# Altium project МИЭМ.467999.001.PrjPcb
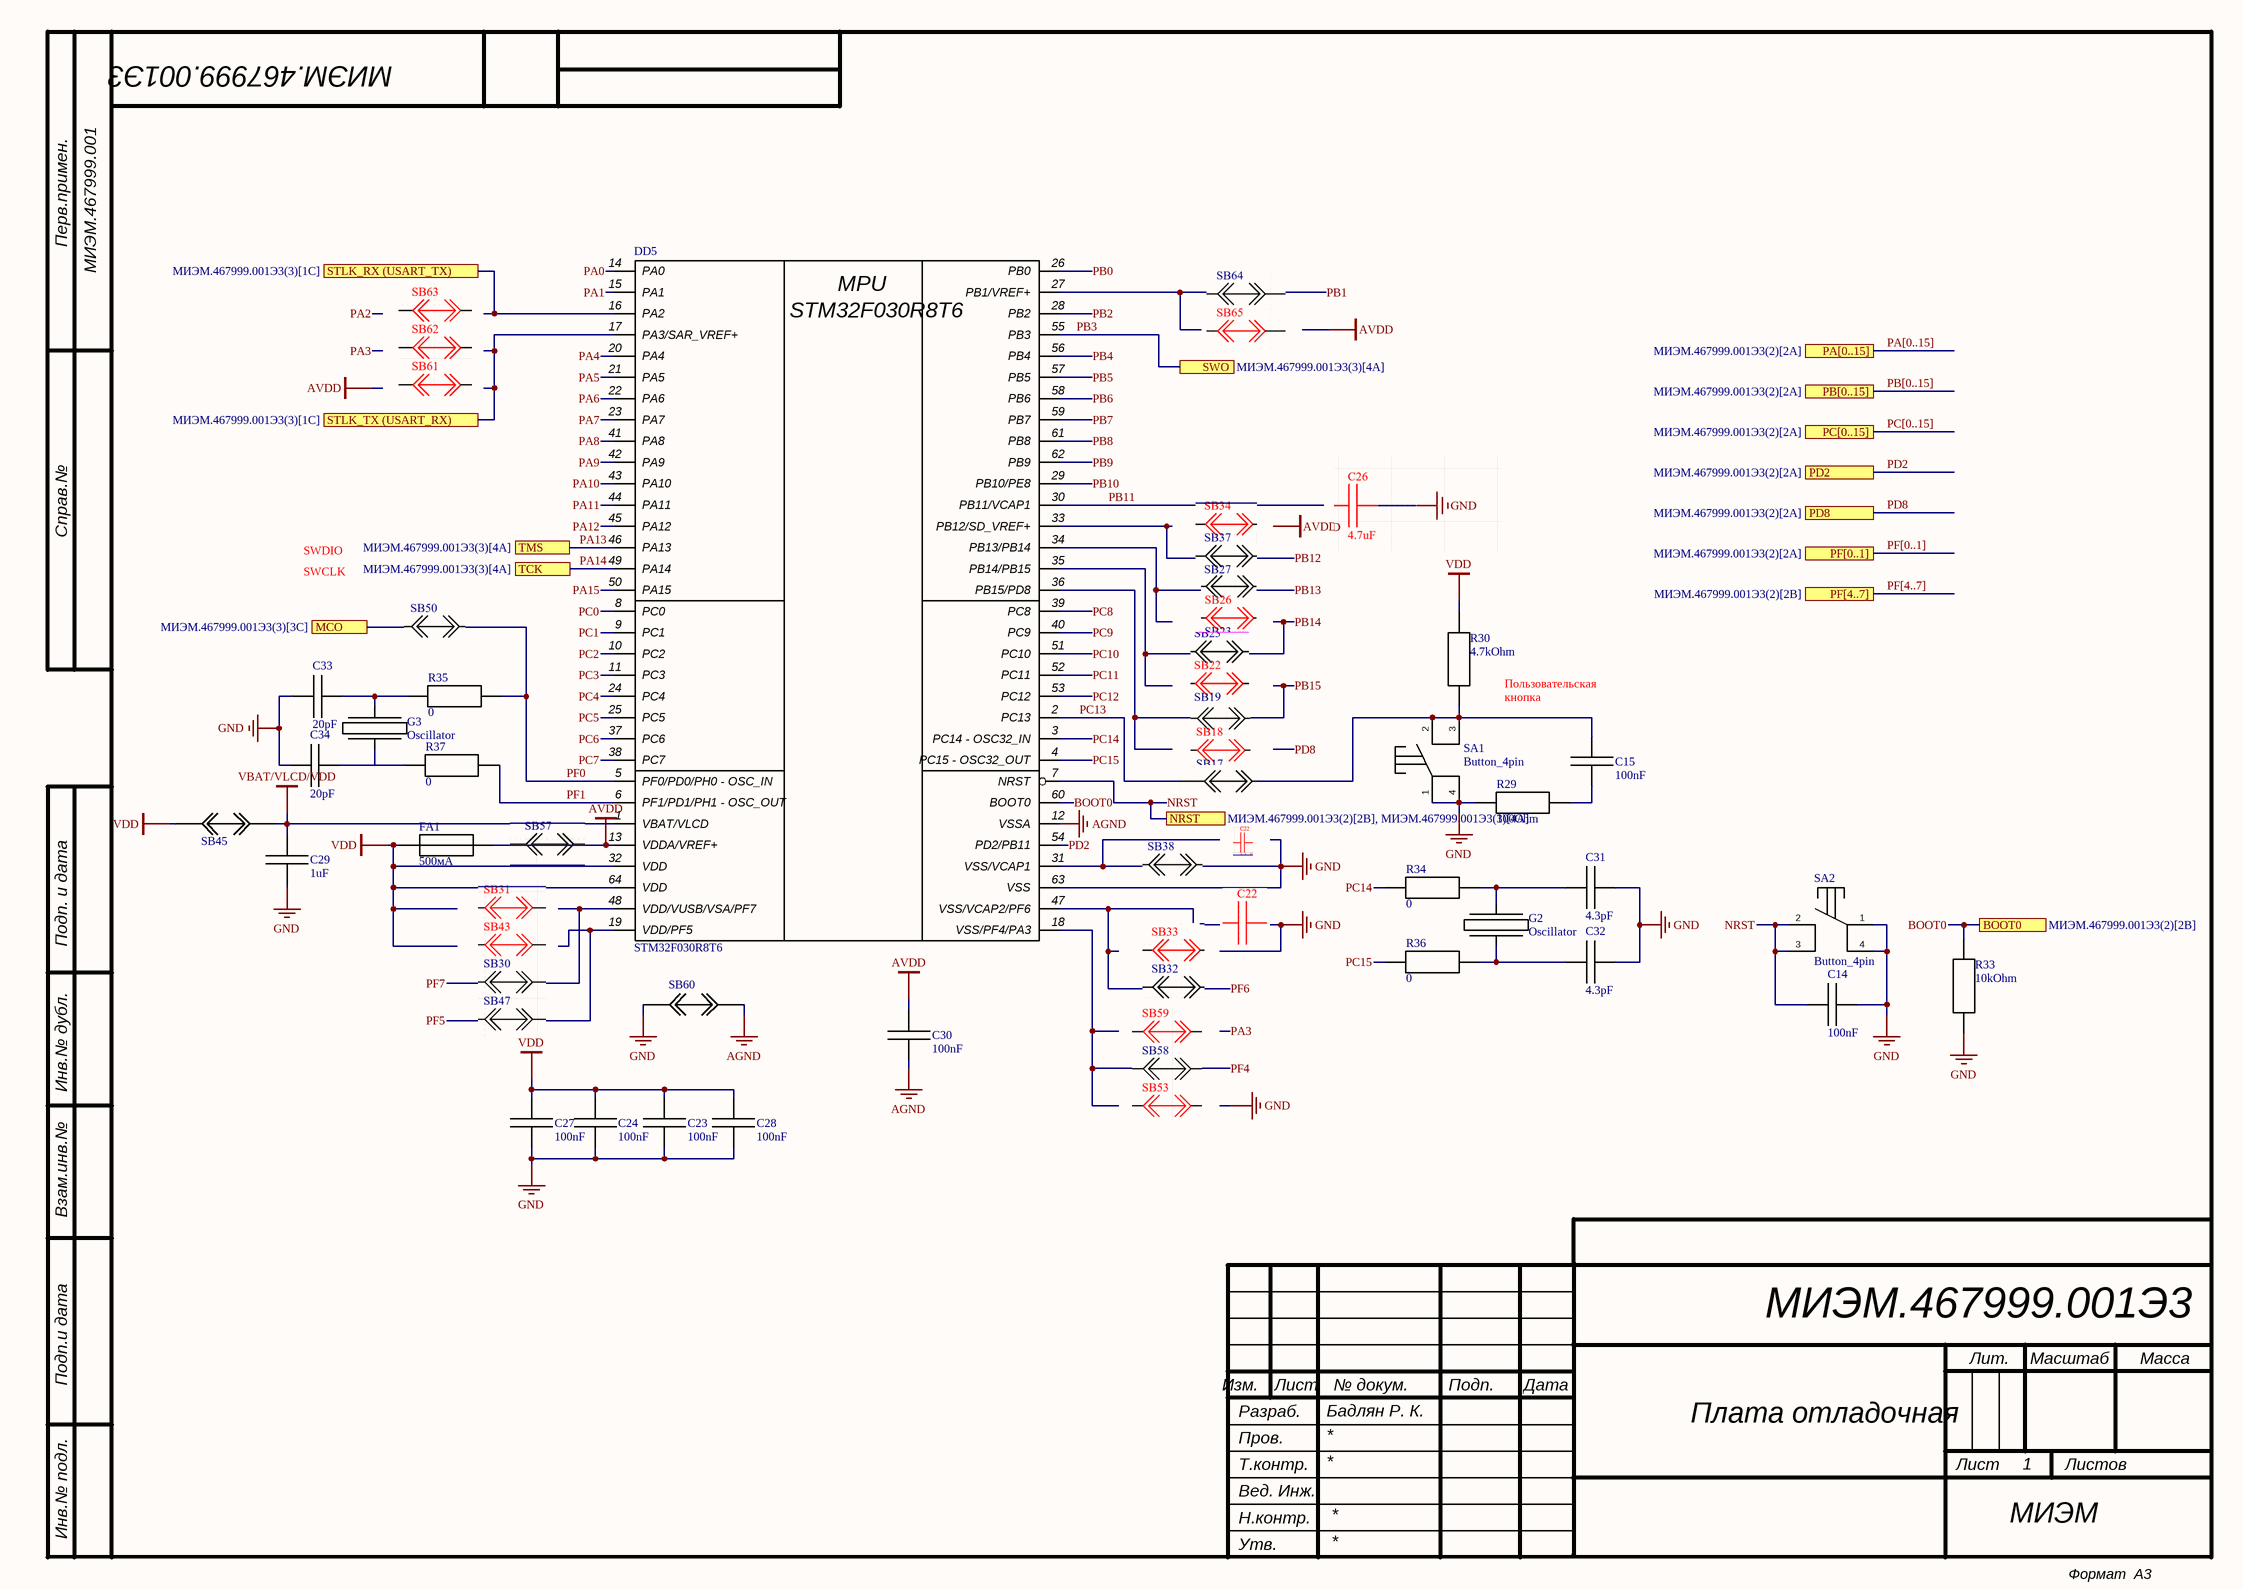
[diagram p0: МИЭМ.467999.001Э3.SchDoc]
Вид_документа_SCH: Схема электрическая принципиальная; Документация0: А3#МИЭМ.467999.001#Схема электрическая принципиальная (Э3)#Э3##; Документация1: А4#МИЭМ.467999.001#Перечень элементов (ПЭ3)#ПЭ3##; Документация2: А3#МИЭМ.467999.001#Ведомость покупных изделий (ВП)#ВП##; Документация3: А3#МИЭМ.467999.001#Сборочный чертеж (СБ)#СБ##; Код_документа_SCH: Э3; Наименование: Плата отладочная; Наименование1: Плата отладочная; Наименование_PCB: Плата печатная многослойная; Обозначение: МИЭМ.467999.001; Обозначение_PCB: МИЭМ.687253.001; Обозначение_Код: МИЭМ.467999.001Э3; Формат_PCB: А3; Характер_работы: Вед. Инж.; п_Доп_графа: Бадалян; п_Доп_графа_Р: Бадалян; п_Разраб: Бадалян; п_Разраб_Р: Бадалян
4 sheets, 112 parts. Net scope: flat (ports and power ports of the same name join across sheets).
Board file: МИЭМ.467999.001.PcbDoc
Sheets:
  МИЭМ.467999.001Э3.SchDoc
  МИЭМ.467999.001Э3(2).SchDoc
  МИЭМ.467999.001Э3(3).SchDoc
  МИЭМ.467999.001Э3(4).SchDoc

## Sheet МИЭМ.467999.001Э3.SchDoc
size 420 x 297 mm; Author: Бадлян Р. К.; CompanyName: МИЭМ; Organization: МИЭМ; SheetNumber: 1; SheetTotal: 4; Name: Плата отладочная; DecimalNumber: МИЭМ.467999.001Э3; MainDevice: МИЭМ.467999.001; Job_Title: Вед. Инж.

### Parts
C14  100nF  [0603]
C15  100nF  [0603]
C23  100nF  [0603]
C24  100nF  [0603]
C27  100nF  [0603]
C28  100nF  [0603]
C29  1uF  [0603]
C30  100nF  [0603]
C31  4.3pF  [0603]
C32  4.3pF  [0603]
C33  20pF  [0603]
C34  20pF  [0603]
DD5  STM32F030R8T6  [LQFP64-10x10mm]
FA1  500мА  [FCM1608KF-601T05]
G2  Oscillator  [ABS25-32.768KHZ-6-T]
G3  Oscillator  [HC49SMD]
R29  100Ohm  [0603]
R30  4.7kOhm  [0603]
R33  10kOhm  [0603]
R34  0  [0603]
R35  0  [0603]
R36  0  [0603]
R37  0  [0603]
SA1  Button_4pin  [Button_4pin]
SA2  Button_4pin  [Button_4pin]
SB45  Jumper  [Jumper]  (value not drawn)
SB60  Jumper  [Jumper]  (value not drawn)

### Ports
BOOT0 (see МИЭМ.467999.001Э3(2)[2B]), MCO (see МИЭМ.467999.001Э3(3)[3C]), NRST (see МИЭМ.467999.001Э3(2)[2B], МИЭМ.467999.001Э3(3)[4A]), PA[0..15] (see МИЭМ.467999.001Э3(2)[2A]), PB[0..15] (see МИЭМ.467999.001Э3(2)[2A]), PC[0..15] (see МИЭМ.467999.001Э3(2)[2A]), PD2 (see МИЭМ.467999.001Э3(2)[2A]), PD8 (see МИЭМ.467999.001Э3(2)[2A]), PF[0..1] (see МИЭМ.467999.001Э3(2)[2A]), PF[4..7] (see МИЭМ.467999.001Э3(2)[2B]), STLK_RX (USART_TX) (see МИЭМ.467999.001Э3(3)[1C]), STLK_TX (USART_RX) (see МИЭМ.467999.001Э3(3)[1C]), SWO (see МИЭМ.467999.001Э3(3)[4A]), TCK (see МИЭМ.467999.001Э3(3)[4A]), TMS (see МИЭМ.467999.001Э3(3)[4A])

### Nets
AGND: C30.1 DD5.12(VSSA) SB60.2
AVDD: C30.2 DD5.13(VDDA/VREF+) FA1.1
GND: C14.1 C23.1 C24.1 C27.1 C28.1 C29.1 C31.1 C32.1 C33.2 C34.2 DD5.31(VSS/VCAP1) DD5.63(VSS) R29.1 R33.1 SA1.1 SA1.4 SA2.1 SA2.4 SB60.1
VBAT/VLCD/VDD: C29.2 DD5.1(VBAT/VLCD) SB45.2
VDD: C23.2 C24.2 C27.2 C28.2 DD5.32(VDD) DD5.64(VDD) FA1.2 R30.2 SB45.1
BOOT0: DD5.60(BOOT0) R33.2 ; port BOOT0
NRST: C14.2 DD5.7(NRST) SA2.2 SA2.3 ; port NRST
PA0: DD5.14(PA0)
PA1: DD5.15(PA1)
PA4: DD5.20(PA4)
PA5: DD5.21(PA5)
PA6: DD5.22(PA6)
PA7: DD5.23(PA7)
PA8: DD5.41(PA8)
PA9: DD5.42(PA9)
PA10: DD5.43(PA10)
PA11: DD5.44(PA11)
PA12: DD5.45(PA12)
PA13: DD5.46(PA13) ; port TMS
PA14: DD5.49(PA14) ; port TCK
PA15: DD5.50(PA15)
PB0: DD5.26(PB0)
PB1: DD5.27(PB1/VREF+)
PB2: DD5.28(PB2)
PB3: DD5.55(PB3) ; port SWO
PB4: DD5.56(PB4)
PB5: DD5.57(PB5)
PB6: DD5.58(PB6)
PB7: DD5.59(PB7)
PB8: DD5.61(PB8)
PB9: DD5.62(PB9)
PB10: DD5.29(PB10/PE8)
PB11: DD5.30(PB11/VCAP1)
PB12: DD5.33(PB12/SD_VREF+)
PB13: DD5.34(PB13/PB14)
PB14: DD5.35(PB14/PB15)
PB15: DD5.36(PB15/PD8)
PC0: DD5.8(PC0)
PC1: DD5.9(PC1)
PC2: DD5.10(PC2)
PC3: DD5.11(PC3)
PC4: DD5.24(PC4)
PC5: DD5.25(PC5)
PC6: DD5.37(PC6)
PC7: DD5.38(PC7)
PC8: DD5.39(PC8)
PC9: DD5.40(PC9)
PC10: DD5.51(PC10)
PC11: DD5.52(PC11)
PC12: DD5.53(PC12)
PC13: C15.2 DD5.2(PC13) R30.1 SA1.2 SA1.3
PC14: DD5.3(PC14_-_OSC32_IN) R34.1
PC15: DD5.4(PC15_-_OSC32_OUT) R36.1
PD2: DD5.54(PD2/PB11) ; port PD2
PF0: DD5.5(PF0/PD0/PH0_-_OSC_IN) R35.2 ; port MCO
PF1: DD5.6(PF1/PD1/PH1_-_OSC_OUT) R37.2
PF4: DD5.18(VSS/PF4/PA3)
PF5: DD5.19(VDD/PF5)
PF6: DD5.47(VSS/VCAP2/PF6)
PF7: DD5.48(VDD/VUSB/VSA/PF7)
STLINK_RX: DD5.16(PA2) ; port STLK_RX (USART_TX)
STLINK_TX: DD5.17(PA3/SAR_VREF+) ; port STLK_TX (USART_RX)
NetC15_1: C15.1 R29.2
NetC31_2: C31.2 G2.1 R34.2
NetC32_2: C32.2 G2.2 R36.2
NetC33_1: C33.1 G3.1 R35.1
NetC34_1: C34.1 G3.2 R37.1

### Buses and harness runs
bus PA[0..15] = port PA[0..15]
bus PB[0..15] = port PB[0..15]
bus PC[0..15] = port PC[0..15]
bus PF[0..1] = port PF[0..1]
bus PF[4..7] = port PF[4..7]

### Notes on the sheet
- SWCLK
- SWDIO
- Пользовательская кнопка
- Labels drawn without touching a wire or pin: AVDD
- Перв.примен.
- Справ.№
- Подп. и дата
- Инв.№ дубл.
- Взам.инв.№
- Подп.и дата
- Разраб.
- Изм.
- Лист
- № докум.
- Подп.
- Дата
- Лит.
- Масштаб
- Масса
- Т.контр.
- Пров.
- Листов
- Инв.№ подл.
- Утв.
- Н.контр.
- Формат  A3
- (in symbol STM32F030R8T6) MPU

### Library data of the parts
C14 C15 C23 C24 C27 C28 C30 = Сapacitor: PartNumber: CC0603KRX7R0BB104; Manufacturer: Yageo; VCC: 100В; Tolerance: 10%; Ta: 125°C; Value: 100nF; Package: 0603; ComponentLink1Description: Datasheet; ComponentLink1URL: *; ComponentLink2Description: Source; ComponentLink2URL: https://www.chipdip.ru/product/0.1mkf-x7r-100v-10-0603-cc0603krx7r0bb104-kondensator-yageo-9000578715
C29 = Сapacitor: PartNumber: GRM185R61A105K; Manufacturer: Murata Electronics; VCC: 10В; Tolerance: 10%; Ta: 85°C; Value: 1uF; Package: 0603; ComponentLink1Description: Datasheet; ComponentLink1URL: *; ComponentLink2Description: Source; ComponentLink2URL: https://www.chipdip.ru/product/1mkf-x5r-10v-10-0603-grm185r61a105k-kondensator-murata-767906735
C31 C32 = Сapacitor: PartNumber: CC0603CRNPO9BN4R3; Manufacturer: Yageo; VCC: 50В; Tolerance: 1%; Ta: 125°C; Value: 4.3pF; Package: 0603; ComponentLink1Description: Datasheet; ComponentLink1URL: *; ComponentLink2Description: Source; ComponentLink2URL: https://www.chipdip.ru/product/4.3pf-np0-50v-0.25pf-0603-cc0603crnpo9bn4r3-yageo-9000952764
C33 C34 = Сapacitor: PartNumber: GRM1885C1H200J; Manufacturer: Murata Electronics; VCC: 50В; Tolerance: 5%; Ta: 155°C; Value: 20pF; Package: 0603; ComponentLink1Description: Datasheet; ComponentLink1URL: *; ComponentLink2Description: Source; ComponentLink2URL: https://www.chipdip.ru/product/20pf-np0-50v-5-0603-grm1885c1h200j-kondensator-murata-268501846
DD5 = STM32F030R8T6: Manufacturer: STMicroelectronics; Frequency: 48МГц; Ta: 85°C; Desc: Микроконтроллер ARM; ComponentLink1Description: Source; ComponentLink1URL: https://www.chipdip.ru/product/stm32f030r8t6-mikrokontroller-arm-st-microelectronics-9000247632; Package: LQFP64-10x10; PartNumber: STM32F030R8T6; ComponentLink2Description: Datasheet; ComponentLink2URL: https://static.chipdip.ru/lib/915/DOC012915875.pdf; ClassName: STM
FA1 = Fuse: Desc: Сердечник ферритовый; Current: 500мА; Package: 0603; PartNumber: FCM1608KF-601T05; ComponentLink1Description: Datasheet; ComponentLink1URL: *; ComponentLink2Description: Source; ComponentLink2URL: https://www.chipdip.ru/product/fcm1608kf-601t05-tai-tech-8040727428
G2 = Oscillator: Desc: Осциллятор кварцевый; Frequence: 32.768КГц; Ta: 85°C; Tolerance: 0.002%; PartNumber: ABS25-32.768KHZ-6-T; ComponentLink1Description: Source; ComponentLink1URL: https://www.chipdip.ru/product/abs25-32.768khz-6-t-abracon-8001972524; ComponentLink2Description: Datasheet; ComponentLink2URL: *; Package: QSMD8x3.8
G3 = Oscillator: Desc: Осциллятор кварцевый; Frequence: 8МГц; Ta: 70°С; PartNumber: *; ComponentLink1Description: Source; ComponentLink1URL: https://www.chipdip.ru/product/hc49smd-8-mhz-20pf-30ppm-ruichi-8022445237; ComponentLink2Description: Datasheet; ComponentLink2URL: *; Tolerance: *; Package: HC49SMD
R29 = Resistor: PartNumber: AC0603FR-07100RL; Manufacturer: Yageo; VCC: 75В; Power: 0.1Вт; Ta: 155°C; Tolerance: 1%; Value: 100Ohm; Package: 0603; ComponentLink1Description: Datasheet; ComponentLink1URL: *; ComponentLink2Description: Source; ComponentLink2URL: https://www.chipdip.ru/product/0.1vt-0603-100-om-1-ac0603fr-07100rl-chip-rezistor-yageo-9000495858
R30 = Resistor: PartNumber: RC0603JR-074K7L; Manufacturer: Yageo; VCC: 75В; Power: 0.1Вт; Ta: 155°C; Tolerance: 5%; Value: 4.7kOhm; Package: 0603; ComponentLink1Description: Datasheet; ComponentLink1URL: *; ComponentLink2Description: Source; ComponentLink2URL: https://www.chipdip.ru/product/0.1vt-0603-4.7-kom-5-rc0603jr-074k7l-chip-rezistor-yageo-9000301240
R33 = Resistor: PartNumber: RC0603FR-0710KL; VCC: 50В; Power: 0.1Вт; Ta: 155°C; Tolerance: 1%; Value: 10kOhm; Package: 0603; Manufacturer: *; ComponentLink1Description: Datasheet; ComponentLink1URL: *; ComponentLink2Description: Source; ComponentLink2URL: https://www.chipdip.ru/product/0.1vt-0603-10-kom-1-chip-rezistor-smd-9000079736
R34-R37 = Resistor: PartNumber: RC0603FR-070RL; Manufacturer: Yageo; VCC: 75В; Power: 0.1Вт; Ta: 155°C; Tolerance: 1%; Value: 0; Package: 0603; ComponentLink1Description: Datasheet; ComponentLink1URL: *; ComponentLink2Description: Source; ComponentLink2URL: https://www.chipdip.ru/product/0.1vt-0603-0-om-1-rc0603fr-070rl-chip-rezistor-smd-yageo-9001227234
SA1 SA2 = Button_4pin: PartNumber: KAN0641-0431B; Desc: Выключатель кнопочный нажимной; ComponentLink1Description: Source; ComponentLink1URL: https://www.chipdip.ru/product/taktovaya-knopka-6.0x-4.3-algoritm-raboty-no-td-06xg-9000914059
SB45 SB60 = Jumper: Desc: Перемычка; State: Установлен

## Sheet МИЭМ.467999.001Э3(2).SchDoc
size 420 x 297 mm; SheetNumber: 2; SheetTotal: 4; DecimalNumber: МИЭМ.467999.001Э3
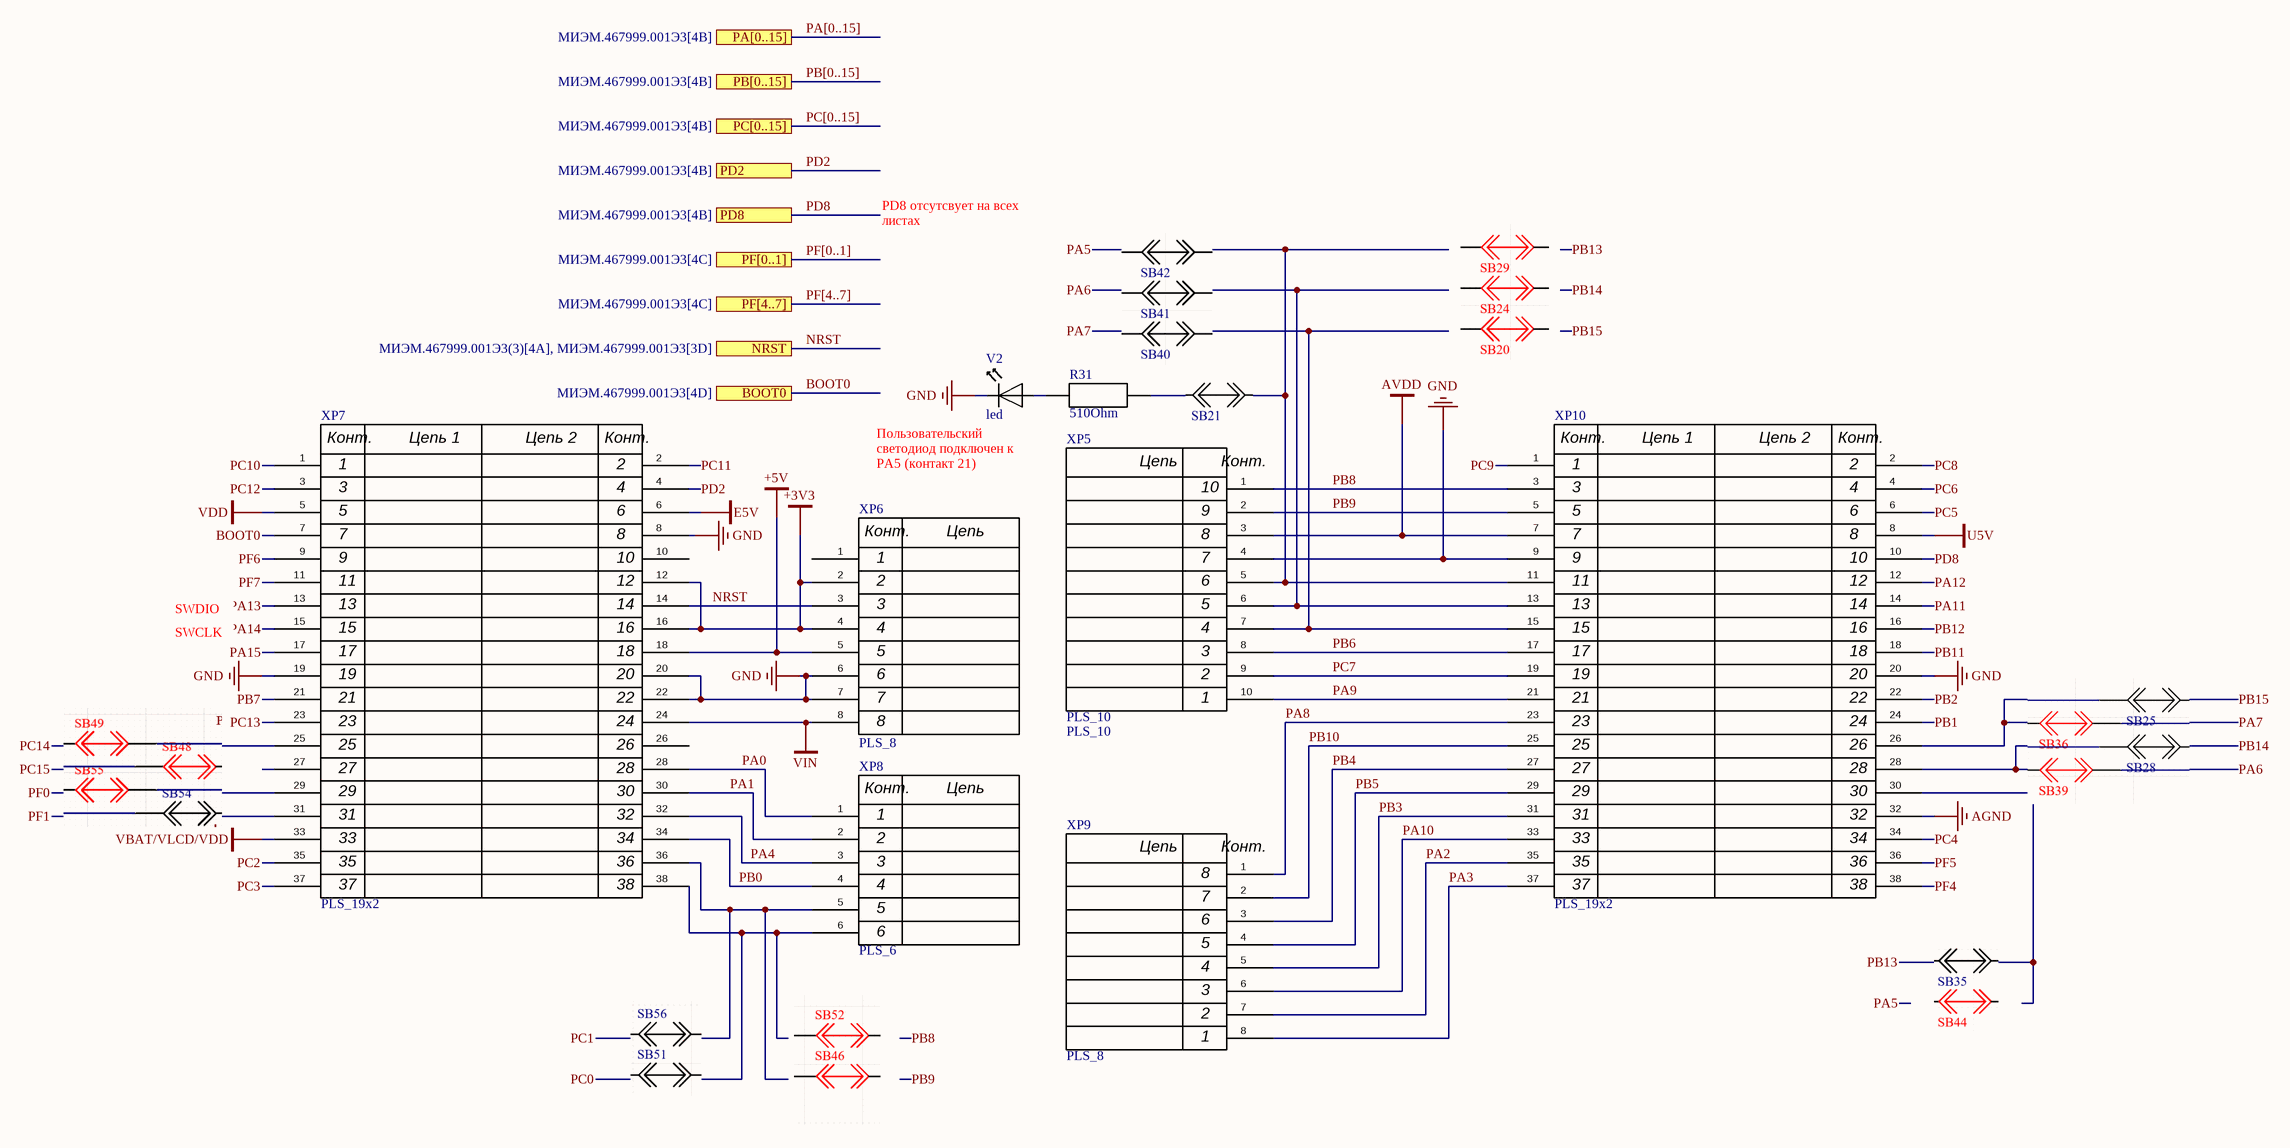
[diagram p1: МИЭМ.467999.001Э3(2).SchDoc]

### Parts
R31  510Ohm  [0603]
V2  led  [FYLS-0603PGC]
XP5  PLS_10  [PLS_10]
XP6  PLS_8  [PLS_8]
XP7  PLS_19x2  [PLS_19x2]
XP8  PLS_6  [PLS_6]
XP9  PLS_8  [PLS_8]
XP10  PLS_19x2  [PLS_19x2]

### Ports
BOOT0 (see МИЭМ.467999.001Э3[4D]), NRST (see МИЭМ.467999.001Э3(3)[4A], МИЭМ.467999.001Э3[3D]), PA[0..15] (see МИЭМ.467999.001Э3[4B]), PB[0..15] (see МИЭМ.467999.001Э3[4B]), PC[0..15] (see МИЭМ.467999.001Э3[4B]), PD2 (see МИЭМ.467999.001Э3[4B]), PD8 (see МИЭМ.467999.001Э3[4B]), PF[0..1] (see МИЭМ.467999.001Э3[4C]), PF[4..7] (see МИЭМ.467999.001Э3[4C])

### Nets
+3V3: XP6.2 XP6.4 XP7.12 XP7.16
+5V: XP6.5 XP7.18
AGND: XP10.32
AVDD: XP5.3 XP10.7
E5V: XP7.6
GND: V2.2 XP5.4 XP6.6 XP6.7 XP7.8 XP7.19 XP7.20 XP7.22 XP10.9 XP10.20
U5V: XP10.8
VBAT/VLCD/VDD: XP7.33
VDD: XP7.5
VIN: XP6.8 XP7.24
BOOT0: XP7.7 ; port BOOT0
NRST: XP6.3 XP7.14 ; port NRST
PA0: XP7.28 XP8.1
PA1: XP7.30 XP8.2
PA2: XP9.7 XP10.35
PA3: XP9.8 XP10.37
PA4: XP7.32 XP8.3
PA5: R31.2 XP5.5 XP10.11
PA6: XP5.6 XP10.13
PA7: XP5.7 XP10.15
PA8: XP9.1 XP10.23
PA9: XP5.10 XP10.21
PA10: XP9.6 XP10.33
PA11: XP10.14
PA12: XP10.12
PA13: XP7.13
PA14: XP7.15
PA15: XP7.17
PB0: XP7.34 XP8.4
PB1: XP10.24
PB2: XP10.22
PB3: XP9.5 XP10.31
PB4: XP9.3 XP10.27
PB5: XP9.4 XP10.29
PB6: XP5.8 XP10.17
PB7: XP7.21
PB8: XP5.1 XP10.3
PB9: XP5.2 XP10.5
PB10: XP9.2 XP10.25
PB11: XP10.18
PB12: XP10.16
PB13: XP10.30
PB14: XP10.28
PB15: XP10.26
PC0: XP7.38 XP8.6
PC1: XP7.36 XP8.5
PC2: XP7.35
PC3: XP7.37
PC4: XP10.34
PC5: XP10.6
PC6: XP10.4
PC7: XP5.9 XP10.19
PC8: XP10.2
PC9: XP10.1
PC10: XP7.1
PC11: XP7.2
PC12: XP7.3
PC13: XP7.23
PD2: XP7.4 ; port PD2
PD8: XP10.10 ; port PD8
PF1: XP7.31
PF4: XP10.38
PF5: XP10.36
PF6: XP7.9
PF7: XP7.11
NetR31_1: R31.1 V2.1

Not connected (* = marked no-connect by the designer): XP6 1; XP7 10 25 26 27 29

### Buses and harness runs
bus PA[0..15] = port PA[0..15]
bus PB[0..15] = port PB[0..15]
bus PC[0..15] = port PC[0..15]
bus PF[0..1] = port PF[0..1]
bus PF[4..7] = port PF[4..7]

### Notes on the sheet
- PD8 отсутсвует на всех листах
- Пользовательский светодиод подключен к PA5 (контакт 21)
- (near XP5) 8
- (near XP5) 10
- (near XP5) 9
- SWDIO
- (near XP6) 1
- (near XP6) 2
- (near XP6) 3
- (near XP5) 7
- (near XP5) 6
- (near XP5) 5
- SWCLK
- (near XP6) 4
- (near XP6) 5
- (near XP6) 6
- (near XP6) 7
- (near XP5) 4
- (near XP5) 3
- (near XP5) 2
- (near XP5) 1
- (near XP6) 8
- (near XP8) 1
- (near XP8) 2
- (near XP8) 3
- (near XP8) 4
- (near XP8) 5
- (near XP9) 8
- (near XP9) 7
- (near XP9) 6
- (near XP8) 6
- (near XP9) 5
- (near XP9) 4
- (near XP9) 3
- (near XP9) 2
- (near XP9) 1
- Подп. и дата
- Инв.№ дубл.
- Взам.инв.№
- Подп.и дата
- Инв.№ подл.
- Изм.
- Лист
- № докум.
- Подп.
- Дата
- Формат  A3
- (in symbol PLS_6) Конт.; Цепь
- (in symbol PLS_8) Конт.; Цепь
- (in symbol PLS_10) Цепь; Конт.
- (in symbol PLS_19x2) Конт.; Цепь 1; Цепь 2

### Library data of the parts
R31 = Resistor: PartNumber: RC0603FR-07510RL; VCC: 50В; Power: 0.063Вт; Ta: 155°C; Tolerance: 1%; Value: 510Ohm; Package: 0603; Manufacturer: *; ComponentLink1Description: Datasheet; ComponentLink1URL: *; ComponentLink2Description: Source; ComponentLink2URL: https://www.chipdip.ru/product/0.1vt-0603-510-om-1-chip-rezistor-smd-9000079669
V2 = led: Manufacturer: Ningbo Foryard Optoelectronics; Desc: Диод светоизлучающий; PartNumber: FYLS-0603PGC; Package: 0603; Color: Зеленый; ComponentLink1Description: Source; ComponentLink1URL: https://www.chipdip.ru/product/fyls-0603pgc-svetodiod-smd-1-6x0-8mm-zelenyy-525nm-foryard-9000204615; Ta: *
XP5 = PLS_10: Desc: Соединение контактное; PartNumber: PLS_10
XP6 XP9 = PLS_8: Desc: Соединение контактное; PartNumber: PLS_8
XP7 XP10 = PLS_19x2: Desc: Соединение контактное; PartNumber: PLS_19x2; ComponentLink1Description: Source; ComponentLink1URL: *
XP8 = PLS_6: Desc: Соединение контактное; PartNumber: PLS_6

## Sheet МИЭМ.467999.001Э3(3).SchDoc
size 420 x 297 mm; SheetNumber: 3; SheetTotal: 4; DecimalNumber: МИЭМ.467999.001Э3
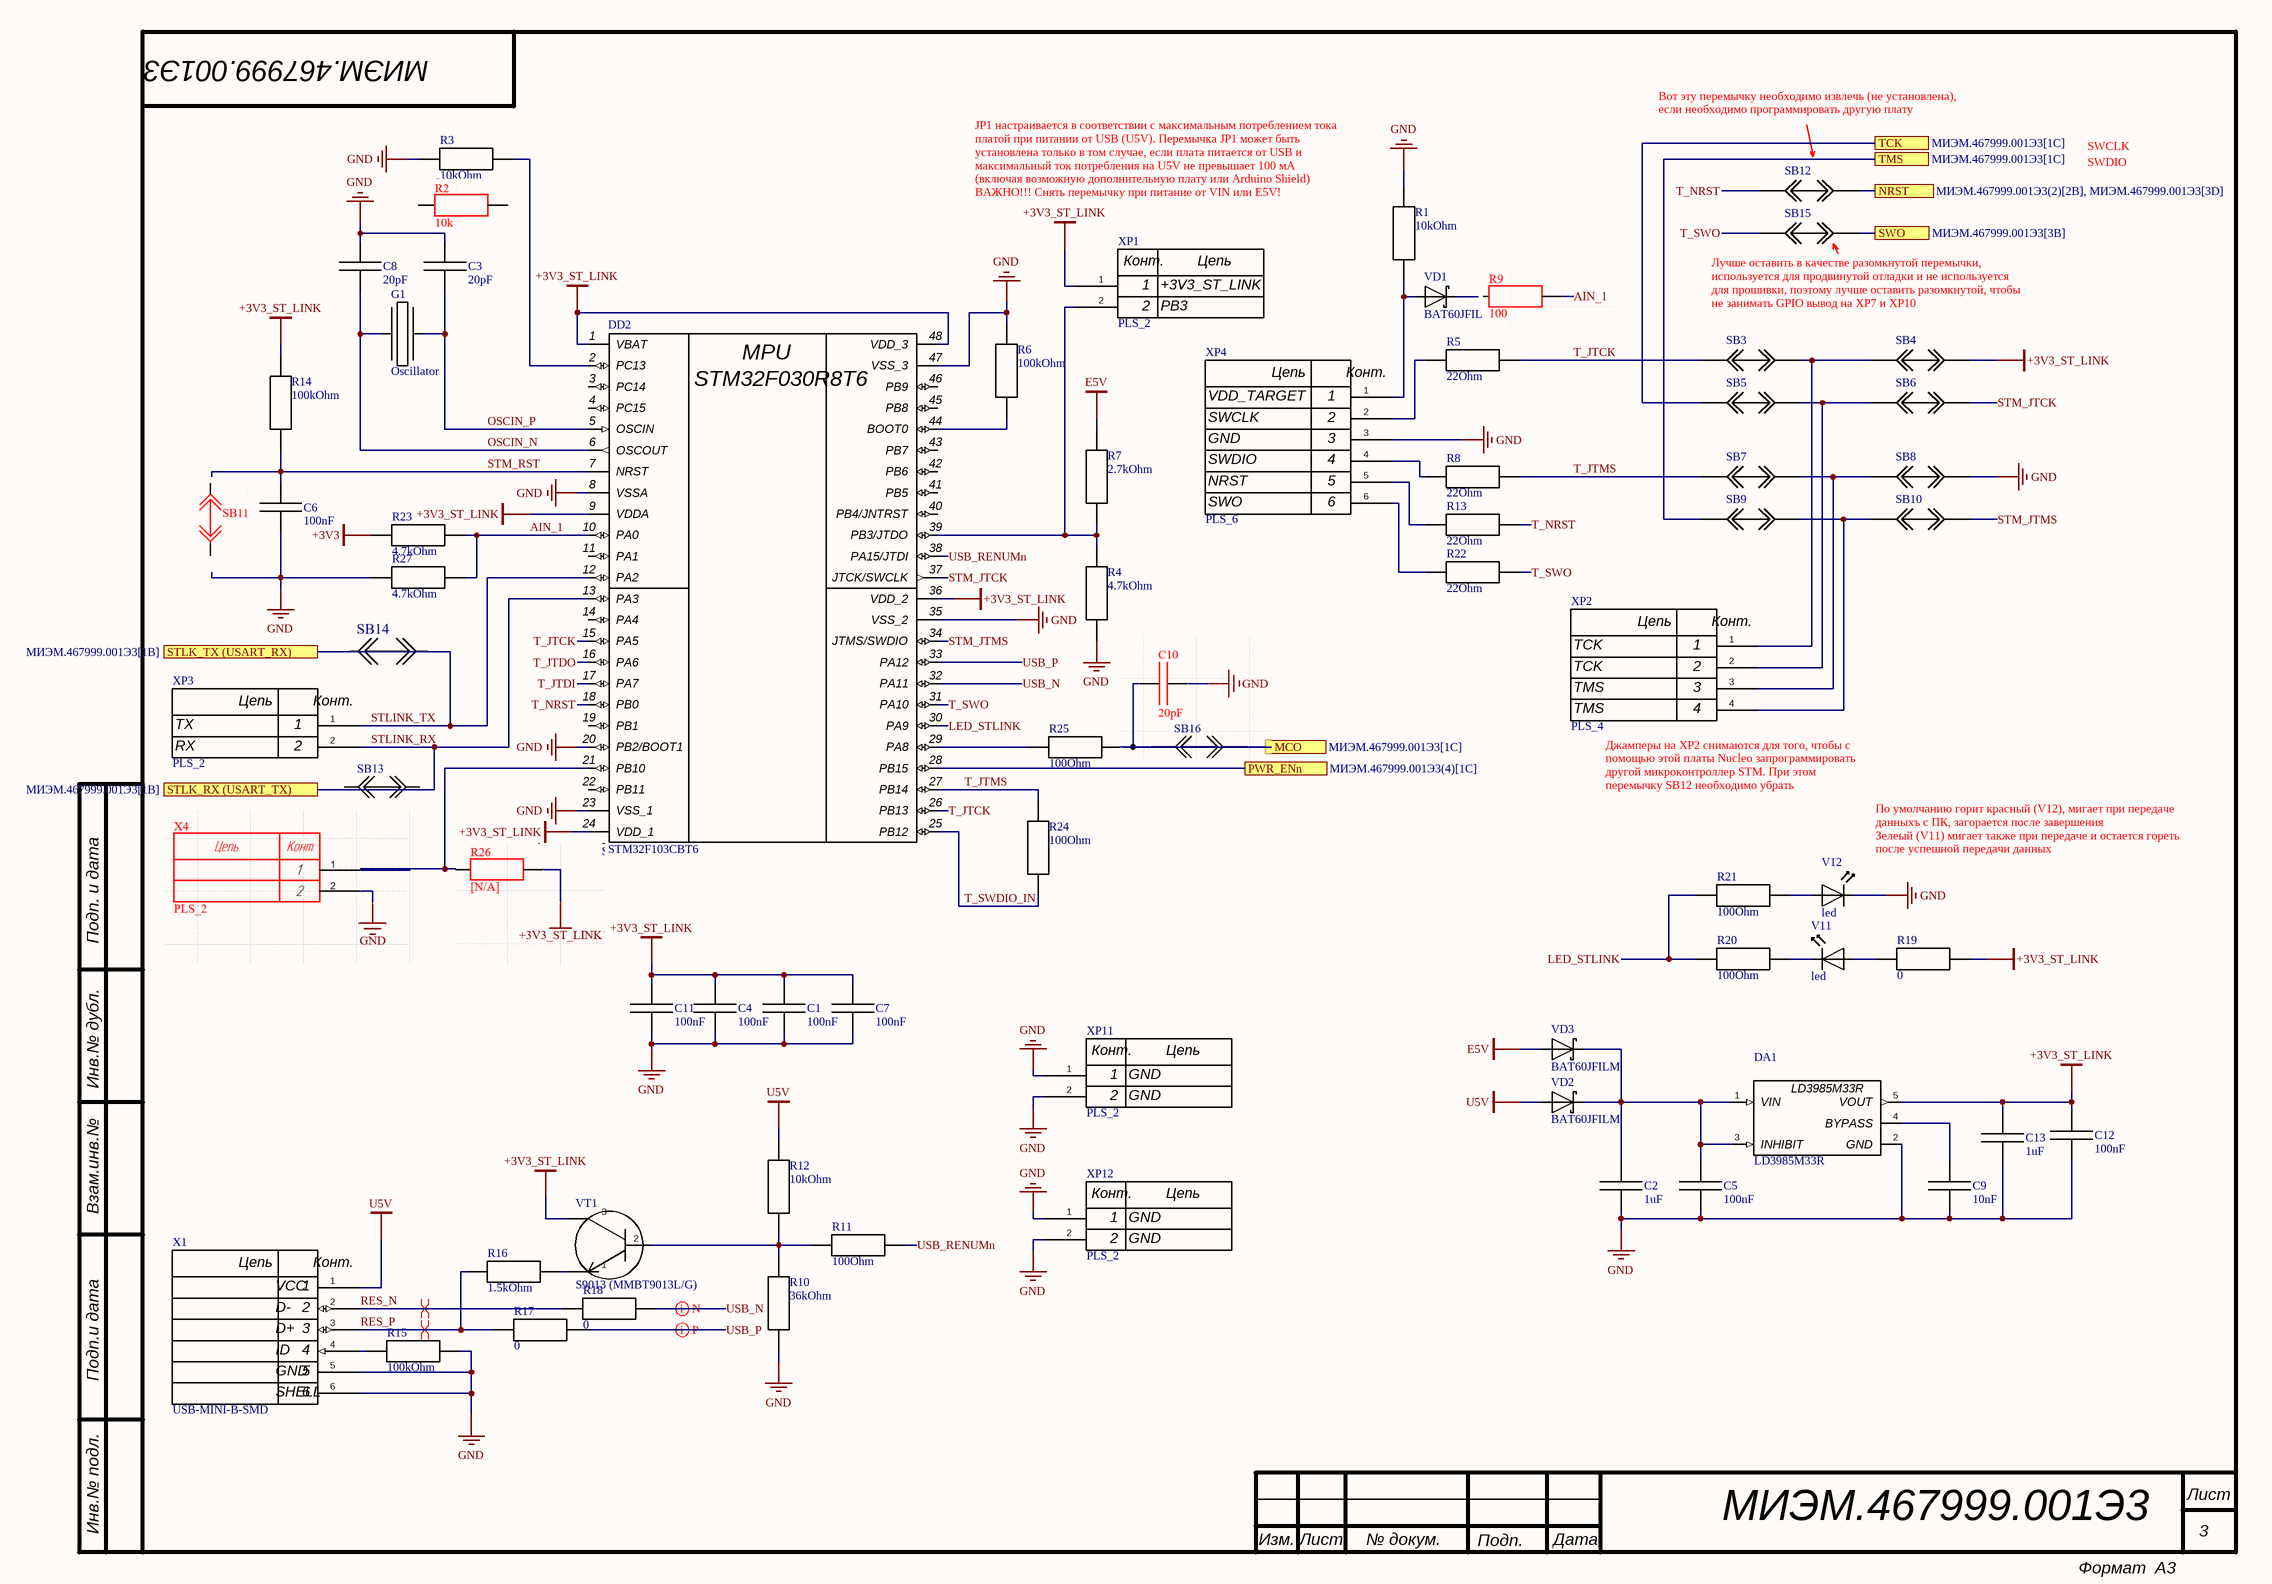
[diagram p2: МИЭМ.467999.001Э3(3).SchDoc]

### Parts
C1  100nF  [0603]
C2  1uF  [0603]
C3  20pF  [0603]
C4  100nF  [0603]
C5  100nF  [0603]
C6  100nF  [0603]
C7  100nF  [0603]
C8  20pF  [0603]
C9  10nF  [0603]
C11  100nF  [0603]
C12  100nF  [0603]
C13  1uF  [0603]
DA1  LD3985M33R  [LD3985M33R (SOT-23-5)]
DD2  STM32F103CBT6  [LQFP48-7x7mm]
G1  Oscillator  [HC49SMD]
R1  10kOhm  [0603]
R3  10kOhm  [0603]
R4  4.7kOhm  [0603]
R5  22Ohm  [0603]
R6  100kOhm  [0603]
R7  2.7kOhm  [0603]
R8  22Ohm  [0603]
R10  36kOhm  [0603]
R11  100Ohm  [0603]
R12  10kOhm  [0603]
R13  22Ohm  [0603]
R14  100kOhm  [0603]
R15  100kOhm  [0603]
R16  1.5kOhm  [0603]
R17  0  [0603]
R18  0  [0603]
R19  0  [0603]
R20  100Ohm  [0603]
R21  100Ohm  [0603]
R22  22Ohm  [0603]
R23  4.7kOhm  [0603]
R24  100Ohm  [0603]
R25  100Ohm  [0603]
R27  4.7kOhm  [0603]
SB3  Jumper  [Jumper]  (value not drawn)
SB4  Jumper  [Jumper]  (value not drawn)
SB5  Jumper  [Jumper]  (value not drawn)
SB6  Jumper  [Jumper]  (value not drawn)
SB7  Jumper  [Jumper]  (value not drawn)
SB8  Jumper  [Jumper]  (value not drawn)
SB9  Jumper  [Jumper]  (value not drawn)
SB10  Jumper  [Jumper]  (value not drawn)
SB12  Jumper  [Jumper]  (value not drawn)
SB15  Jumper  [Jumper]  (value not drawn)
V11  led  [FYLS-0603PGC]
V12  led  [FYLS-0603PGC]
VD1  BAT60JFILM  [BAT60JFILM]
VD2  BAT60JFILM  [BAT60JFILM]
VD3  BAT60JFILM  [BAT60JFILM]
VT1  S9013 (MMBT9013L/G)  [S9013 (SOT_23_3)]
X1  USB-MINI-B-SMD  [USB-MINI-B-SMD]
XP1  PLS_2  [PLS_2]
XP2  PLS_4  [PLS_4]
XP3  PLS_2  [PLS_2]
XP4  PLS_6  [PLS_6]
XP11  PLS_2  [PLS_2]
XP12  PLS_2  [PLS_2]

### Ports
MCO (see МИЭМ.467999.001Э3[1C]), NRST (see МИЭМ.467999.001Э3(2)[2B], МИЭМ.467999.001Э3[3D]), PWR_ENn (see МИЭМ.467999.001Э3(4)[1C]), STLK_RX (USART_TX) (see МИЭМ.467999.001Э3[1B]), STLK_TX (USART_RX) (see МИЭМ.467999.001Э3[1B]), SWO (see МИЭМ.467999.001Э3[3B]), TCK (see МИЭМ.467999.001Э3[1C]), TMS (see МИЭМ.467999.001Э3[1C])

### Nets
+3V3: R23.1
+3V3_ST_LINK: C1.2 C4.2 C7.2 C11.2 C12.2 C13.2 DA1.5(VOUT) DD2.1(VBAT) DD2.9(VDDA) DD2.24(VDD_1) DD2.36(VDD_2) DD2.48(VDD_3) R14.2 R19.2 SB4.2 VT1.3 XP1.1
E5V: R7.2 VD3.2
GND: C1.1 C2.1 C3.2 C4.1 C5.1 C6.1 C7.1 C8.2 C9.1 C11.1 C12.1 C13.1 DA1.2(GND) DD2.8(VSSA) DD2.20(PB2/BOOT1) DD2.23(VSS_1) DD2.35(VSS_2) DD2.47(VSS_3) R1.1 R3.1 R4.1 R6.2 R10.1 R15.2 R27.1 SB8.2 V12.2 X1.5 X1.6 XP4.3 XP11.1 XP11.2 XP12.1 XP12.2
U5V: R12.2 VD2.2 X1.1
AIN_1: DD2.10(PA0) R23.2 R27.2
LED_STLINK: DD2.30(PA9) R20.1 R21.1
NRST: SB12.2 ; port NRST
OSCIN_N: C8.1 DD2.6(OSCOUT) G1.1
OSCIN_P: C3.1 DD2.5(OSCIN) G1.2
PA13: SB9.1 ; port TMS
PA14: SB5.1 ; port TCK
PB3: SB15.2 ; port SWO
PF0: R25.1 ; port MCO
PWR_ENn: DD2.28(PB15) ; port PWR_ENn
RES_N: R18.1 X1.2
RES_P: R16.1 R17.1 X1.3
STLINK_RX: DD2.13(PA3) XP3.2 ; port STLK_RX (USART_TX)
STLINK_TX: DD2.12(PA2) XP3.1 ; port STLK_TX (USART_RX)
STM_JTCK: DD2.37(JTCK/SWCLK) SB6.2
STM_JTMS: DD2.34(JTMS/SWDIO) SB10.2
STM_RST: C6.2 DD2.7(NRST) R14.1
T_JTCK: DD2.15(PA5) DD2.26(PB13) R5.1 SB3.1
T_JTDI: DD2.17(PA7)
T_JTDO: DD2.16(PA6)
T_JTMS: DD2.27(PB14) R8.1 R24.2 SB7.1
T_NRST: DD2.18(PB0) R13.1 SB12.1
T_SWDIO_IN: DD2.25(PB12) R24.1
T_SWO: DD2.31(PA10) R22.1 SB15.1
USB_N: DD2.32(PA11) R18.2
USB_P: DD2.33(PA12) R17.2
USB_RENUMn: DD2.38(PA15/JTDI) R11.1
NetC2_2: C2.2 C5.2 DA1.1(VIN) DA1.3(INHIBIT) VD2.1 VD3.1
NetC9_2: C9.2 DA1.4(BYPASS)
NetDD2_2: DD2.2(PC13) R3.2
NetDD2_29: DD2.29(PA8) R25.2
NetDD2_39: DD2.39(PB3/JTDO) R4.2 R7.1 XP1.2
NetDD2_44: DD2.44(BOOT0) R6.1
NetR1_2: R1.2 VD1.2 XP4.1
NetR5_2: R5.2 XP4.2
NetR8_2: R8.2 XP4.4
NetR10_2: R10.2 R11.2 R12.1 VT1.2
NetR13_2: R13.2 XP4.5
NetR15_1: R15.1 X1.4
NetR16_2: R16.2 VT1.1
NetR19_1: R19.1 V11.1
NetR20_2: R20.2 V11.2
NetR21_2: R21.2 V12.1
NetR22_2: R22.2 XP4.6
NetSB3_2: SB3.2 SB4.1 XP2.1
NetSB5_2: SB5.2 SB6.1 XP2.2
NetSB7_2: SB7.2 SB8.1 XP2.3
NetSB9_2: SB9.2 SB10.1 XP2.4

Not connected (* = marked no-connect by the designer): DD2 3(PC14) 4(PC15) 11(PA1) 14(PA4) 19(PB1) 21(PB10) 22(PB11) 40(PB4/JNTRST) 41(PB5) 42(PB6) 43(PB7) 45(PB8) 46(PB9); VD1 1

### Layout directives
differential pair: RES_N, RES_P, USB_N, USB_P

### Notes on the sheet
- Вот эту перемычку необходимо извлечь (не установлена), если необходимо программировать другую плату
- SWCLK
- SWDIO
- JP1 настраивается в соответствии с максимальным потреблением тока платой при питании от USB (U5V). Перемычка JP1 может быть установлена только в том случае, если плата питается от USB и максимальный ток потребления на U5V не превышает 100 мА (включая возможную дополнительную плату или Arduino Shield)
  ВАЖНО!!! Снять перемычку при питание от VIN или E5V!
- (near XP1) 1
- (near XP1) 2
- (near XP1) +3V3_ST_LINK
- (near XP1) PB3
- (near SB15) Лучше оставить в качестве разомкнутой перемычки, используется для продвинутой отладки и не используется для прошивки, поэтому лучше оставить разомкнутой, чтобы не занимать GPIO вывод на XP7 и XP10
- VDD_TARGET
- GND
- (near XP4) 1
- (near XP4) 2
- (near XP4) 3
- NRST
- SWO
- (near XP4) 4
- (near XP4) 5
- (near XP4) 6
- TCK
- (near XP2) 1
- TX
- (near XP3) 1
- TMS
- (near XP2) 2
- (near XP2) 3
- (near XP2) 4
- RX
- (near XP3) 2
- (near XP2) Джамперы на XP2 снимаются для того, чтобы с помощью этой платы Nucleo запрограммировать другой микроконтроллер STM. При этом перемычку SB12 необходимо убрать
- (near V12) По умолчанию горит красный (V12), мигает при передаче данныхъ с ПК, загорается после завершения
  Зелеый (V11) мигает также при передаче и остается гореть после успешной передачи данных
- (near XP11) 1
- (near XP11) 2
- (near XP11) GND
- (near XP12) 1
- (near XP12) 2
- (near XP12) GND
- Подп. и дата
- Инв.№ дубл.
- Взам.инв.№
- Подп.и дата
- Инв.№ подл.
- Изм.
- Лист
- № докум.
- Подп.
- Дата
- Формат  A3
- (in symbol PLS_2) Цепь; Конт.
- (in symbol PLS_4) Цепь; Конт.
- (in symbol PLS_6) Цепь; Конт.
- (in symbol STM32F103CBT6) MPU; STM32F030R8T6
- (in symbol USB-MINI-B-SMD) Цепь; Конт.; VCC; D-; D+; ID; GND; SHELL

### Library data of the parts
C1 C4-C7 C11 C12 = Сapacitor: as C14 on sheet МИЭМ.467999.001Э3; Value: 100nF; Package: 0603; ComponentLink1Description: Datasheet; ComponentLink1URL: *; ComponentLink2Description: Source
  C1 C5 C6 C11 C12: ComponentLink2URL: https://www.chipdip.ru/product/0.1mkf-x7r-100v-10-0603-cc0603krx7r0bb104-kondensator-yageo-9000578715
  C4 C7: ComponentLink2URL: *
C2 C13 = Сapacitor: as C29 on sheet МИЭМ.467999.001Э3; Value: 1uF; Package: 0603; ComponentLink1Description: Datasheet; ComponentLink1URL: *; ComponentLink2Description: Source; ComponentLink2URL: https://www.chipdip.ru/product/1mkf-x5r-10v-10-0603-grm185r61a105k-kondensator-murata-767906735
C3 C8 = Сapacitor: PartNumber: GRM1885C1H200J; Manufacturer: Murata Electronics; VCC: 50В; Tolerance: 5%; Ta: 125°C; Value: 20pF; Package: 0603; ComponentLink1Description: Datasheet; ComponentLink1URL: *; ComponentLink2Description: Source; ComponentLink2URL: https://www.chipdip.ru/product/20pf-np0-50v-5-0603-grm1885c1h200j-kondensator-murata-268501846
C9 = Сapacitor: PartNumber: CC0603KRX7R0BB103; Manufacturer: Yageo; VCC: 100В; Tolerance: 10%; Ta: 125°C; Value: 10nF; Package: 0603; ComponentLink1Description: Datasheet; ComponentLink1URL: *; ComponentLink2Description: Source; ComponentLink2URL: https://www.chipdip.ru/product/0.01mkf-x7r-100v-10-0603-cc0603krx7r0bb103-yageo-9000501772
DA1 = LD3985M33R: Manufacturer: STMicroelectronics; Desc: Стабилизатор напряжения линейный; VCC: 6 В; Vout: 3.3 В; Ta: 125 °C; ComponentLink1Description: Source; ComponentLink1URL: https://www.chipdip.ru/product/ld3985m33r-regulyator-s-nizkim-padeniem-st-microelectronics-9060001543; ComponentLink2Description: Datasheet; ComponentLink2URL: *; Package: SOT-23-5
DD2 = STM32F103CBT6: Manufacturer: STMicroelectronics; Desc: Микроконтроллер 32-Бит; Frequency: 72МГц; Ta: 85°C; ComponentLink1Description: Source; ComponentLink1URL: https://www.chipdip.ru/product/stm32f103cbt6-mikrokontroller-32-bit-st-microelectronics-9000052539; ComponentLink2Description: Datasheet; ComponentLink2URL: https://static.chipdip.ru/lib/597/DOC018597489.pdf; Package: LQFP-48; PartNumber: STM32F103CBT6; ClassName: STM
G1 = Oscillator: as G3 on sheet МИЭМ.467999.001Э3; ComponentLink1Description: Source; ComponentLink1URL: https://www.chipdip.ru/product/hc49smd-8-mhz-20pf-30ppm-kvartsevyy-rezonator-ruichi-8007334696; ComponentLink2Description: Datasheet; ComponentLink2URL: *; Tolerance: *
R1 R3 R12 = Resistor: as R33 on sheet МИЭМ.467999.001Э3; Value: 10kOhm; Package: 0603; Manufacturer: *; ComponentLink1Description: Datasheet; ComponentLink1URL: *; ComponentLink2Description: Source; ComponentLink2URL: https://www.chipdip.ru/product/0.1vt-0603-10-kom-1-chip-rezistor-smd-9000079736
R4 R23 R27 = Resistor: as R30 on sheet МИЭМ.467999.001Э3; Value: 4.7kOhm; Package: 0603; ComponentLink1Description: Datasheet; ComponentLink1URL: *; ComponentLink2Description: Source; ComponentLink2URL: https://www.chipdip.ru/product/0.1vt-0603-4.7-kom-5-rc0603jr-074k7l-chip-rezistor-yageo-9000301240
R5 R8 R13 R22 = Resistor: PartNumber: RC0603FR-0722RL; VCC: 50В; Power: 0.1Вт; Ta: 155°C; Tolerance: 1%; Value: 22Ohm; Package: 0603; Manufacturer: *; ComponentLink1Description: Datasheet; ComponentLink1URL: *; ComponentLink2Description: Source; ComponentLink2URL: https://www.chipdip.ru/product/0.1vt-0603-22-om-1-chip-rezistor-smd-9000079564
R6 R14 R15 = Resistor: PartNumber: 0603WAF1003T5E; Manufacturer: UNI-ROYAL(Uniroyal Elec); VCC: 75В; Power: 0.1Вт; Ta: 155°C; Tolerance: 1%; Value: 100kOhm; Package: 0603; ComponentLink1Description: Datasheet; ComponentLink1URL: *; ComponentLink2Description: Source; ComponentLink2URL: https://www.chipdip.ru/product/0603waf1003t5e-rezistor-tolstoplenochnyy-100mvt-uni-royal-8033183962
R7 = Resistor: PartNumber: RC0603JR-072K7L; Manufacturer: Yageo; VCC: 75В; Power: 0.1Вт; Ta: 155°C; Tolerance: 5%; Value: 2.7kOhm; Package: 0603; ComponentLink1Description: Datasheet; ComponentLink1URL: *; ComponentLink2Description: Source; ComponentLink2URL: https://www.chipdip.ru/product/0.1vt-0603-2.7-kom-5-rc0603jr-072k7l-chip-rezistor-yageo-9000381530
R10 = Resistor: PartNumber: RC0603JR-0736KL; Manufacturer: Yageo; VCC: 75В; Power: 0.1Вт; Ta: 155°C; Tolerance: 5%; Value: 36kOhm; Package: 0603; ComponentLink1Description: Datasheet; ComponentLink1URL: *; ComponentLink2Description: Source; ComponentLink2URL: https://www.chipdip.ru/product/0.1vt-0603-36-kom-5-rc0603jr-0736kl-chip-rezistor-smd-yageo-9001745834
R11 R20 R21 R24 R25 = Resistor: as R29 on sheet МИЭМ.467999.001Э3; Value: 100Ohm; Package: 0603; ComponentLink1Description: Datasheet; ComponentLink1URL: *; ComponentLink2Description: Source; ComponentLink2URL: https://www.chipdip.ru/product/0.1vt-0603-100-om-1-ac0603fr-07100rl-chip-rezistor-yageo-9000495858
R16 = Resistor: PartNumber: RC0603FR-071K5L; VCC: 50В; Power: 0.1Вт; Ta: 155°C; Tolerance: 1%; Value: 1.5kOhm; Package: 0603; Manufacturer: *; ComponentLink1Description: Datasheet; ComponentLink1URL: *; ComponentLink2Description: Source; ComponentLink2URL: https://www.chipdip.ru/product/0.1vt-0603-1.5-kom-1-chip-rezistor-smd-9000079716
R17-R19 = Resistor: as R34 on sheet МИЭМ.467999.001Э3; Value: 0; Package: 0603; ComponentLink1Description: Datasheet; ComponentLink1URL: *; ComponentLink2Description: Source; ComponentLink2URL: https://www.chipdip.ru/product/0.1vt-0603-0-om-1-rc0603fr-070rl-chip-rezistor-smd-yageo-9001227234
SB3 SB5 SB7 SB9 SB12 SB15 = Jumper: Desc: Перемычка; State: Установлен
SB4 SB6 SB8 SB10 = Jumper: Desc: Перемычка; State: Не установлен
V11 V12 = led: as V2 on sheet МИЭМ.467999.001Э3(2); PartNumber: FYLS-0603PGC; Package: 0603; Color: Зеленый; ComponentLink1Description: Source; Ta: *
  V11: ComponentLink1URL: *
  V12: ComponentLink1URL: https://www.chipdip.ru/product/fyls-0603pgc-svetodiod-smd-1-6x0-8mm-zelenyy-525nm-foryard-9000204615
VD1-VD3 = BAT60JFILM: Manufacturer: STMicroelectronics; VCC: 10В; Desc: Диод Шоттки; Ta: 125°C; ComponentLink1Description: Source; ComponentLink1URL: https://www.chipdip.ru/product/bat60jfilm-diod-shottki-3a-10v-sod-323-st-microelectronics-9000198985; Package: SOD-323; ComponentLink2Description: Datasheet; ComponentLink2URL: *
VT1 = S9013 (MMBT9013L/G): Manufacturer: Hottech; VCC: 40В; Power: 0.3Вт; Ta: 150°C; Type: NPN; ComponentLink1Description: Source; ComponentLink1URL: https://www.chipdip.ru/product/s9013-tranzistor-npn-25v-0.5a-hfe-120-400-0.3vt-hottech-9001276075; ComponentLink2Description: Datasheet; ComponentLink2URL: *; Package: SOT-23-3; PartNumber: S9013
X1 = USB-MINI-B-SMD: PartNumber: 1734035-1; Desc: Разъем mini-USB на плату SMD; ComponentLink1Description: Source; ComponentLink1URL: https://www.chipdip.ru/product/1734035-1-razem-mini-usb-na-platu-smd-te-connectivity-9000149111
XP1 XP3 XP11 XP12 = PLS_2: Desc: Соединение контактное; PartNumber: PLS_2
XP2 = PLS_4: Desc: Соединение контактное; PartNumber: PLS_4
XP4 = PLS_6: Desc: Соединение контактное; PartNumber: PLS_6

## Sheet МИЭМ.467999.001Э3(4).SchDoc
size 420 x 297 mm; SheetNumber: 4; SheetTotal: 4; DecimalNumber: МИЭМ.467999.001Э3
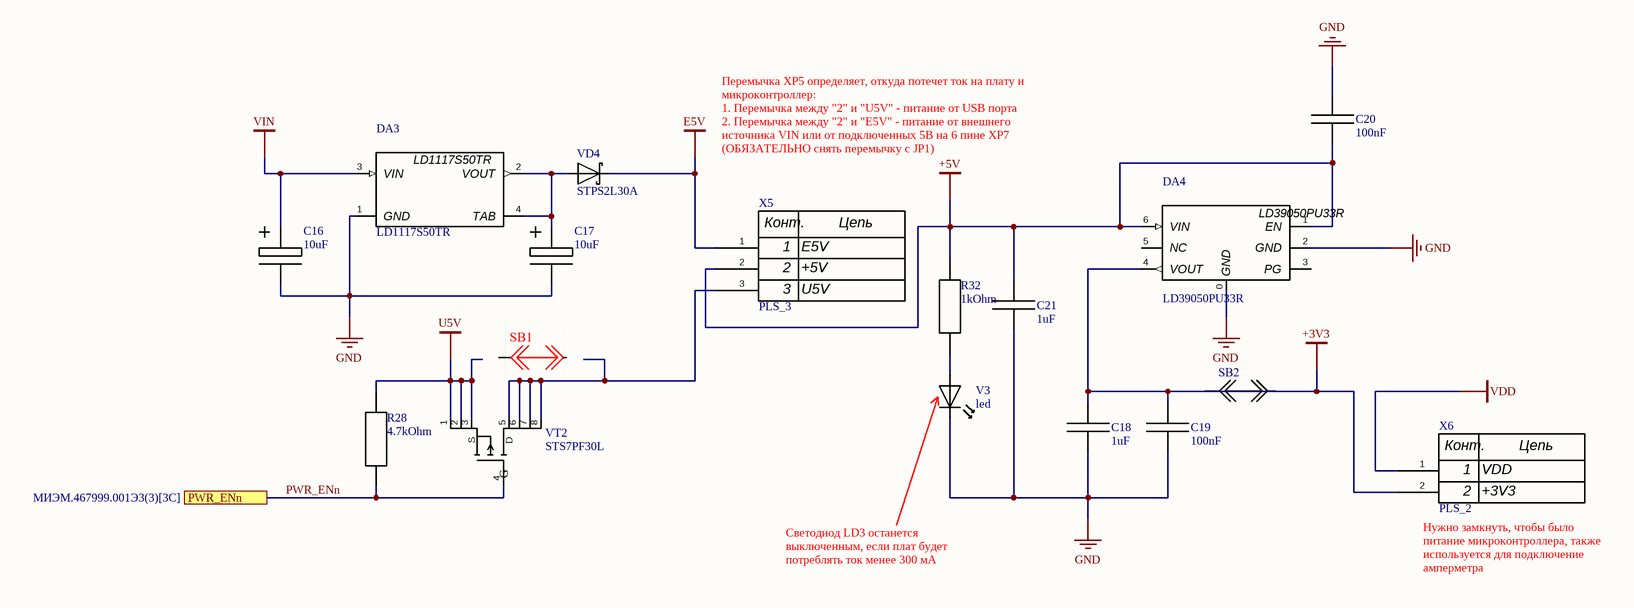
[diagram p3: МИЭМ.467999.001Э3(4).SchDoc]

### Parts
C16  10uF  [TAJB106K025R]
C17  10uF  [TAJB106K025R]
C18  1uF  [0603]
C19  100nF  [0603]
C20  100nF  [0603]
C21  1uF  [0603]
DA3  LD1117S50TR  [LD1117S50TR (SOT-223)]
DA4  LD39050PU33R  [LD39050PU33R (DFN6 (3x3 mm))]
R28  4.7kOhm  [0603]
R32  1kOhm  [0603]
V3  led  [FYLS-0603PGC]
VD4  STPS2L30A  [STPS2L30A]
VT2  STS7PF30L  [STS7PF30L]
X5  PLS_3  [PLS_3]
X6  PLS_2  [PLS_2]

### Ports
PWR_ENn (see МИЭМ.467999.001Э3(3)[3C])

### Nets
+3V3: C18.2 C19.2 DA4.4(VOUT) X6.2
+5V: C20.1 C21.2 DA4.1(EN) DA4.6(VIN) R32.2 X5.2
E5V: VD4.1 X5.1
GND: C16.2 C17.2 C18.1 C19.1 C20.2 C21.1 DA3.1(GND) DA4.0(GND) DA4.2(GND) V3.2
U5V: R28.2 VT2.1(S) VT2.2(S) VT2.3(S)
VDD: X6.1
VIN: C16.1 DA3.3(VIN)
PWR_ENn: R28.1 VT2.4(G) ; port PWR_ENn
NetC17_1: C17.1 DA3.2(VOUT) DA3.4(TAB) VD4.2
NetR32_1: R32.1 V3.1
NetVT2_5: VT2.5(D) VT2.6(D) VT2.7(D) VT2.8(D) X5.3

Not connected (* = marked no-connect by the designer): DA4 3(PG) 5(NC)

### Notes on the sheet
- Перемычка XP5 определяет, откуда потечет ток на плату и микроконтроллер:
  1. Перемычка между "2" и "U5V" - питание от USB порта
  2. Перемычка между "2" и "E5V" - питание от внешнего источника VIN или от подключенных 5В на 6 пине XP7 (ОБЯЗАТЕЛЬНО снять перемычку с JP1)
- (near X5) 1
- (near X5) E5V
- (near X5) 2
- (near X5) 3
- (near X5) +5V
- (near X5) U5V
- (near X6) 1
- (near X6) 2
- (near X6) VDD
- (near X6) +3V3
- Cветодиод LD3 останется выключенным, если плат будет потреблять ток менее 300 мА
- (near X6) Нужно замкнуть, чтобы было питание микроконтроллера, также используется для подключение амперметра
- Подп. и дата
- Инв.№ дубл.
- Взам.инв.№
- Подп.и дата
- Инв.№ подл.
- Изм.
- Лист
- № докум.
- Подп.
- Дата
- Формат  A3
- (in symbol PLS_2) Конт.; Цепь
- (in symbol PLS_3) Конт.; Цепь

### Library data of the parts
C16 C17 = Polarized Capacitor: PartNumber: TAJB106K025RNJ; Manufacturer: Kyocera AVX; VCC: 25В; Tolerance: 10%; Ta: 125℃; Value: 10uF; Package: 1411; ComponentLink1Description: Datasheet; ComponentLink1URL: *; ComponentLink2Description: Source
  C16: ComponentLink2URL: *
  C17: ComponentLink2URL: https://www.chipdip.ru/product/tajb106k025rnj-kyocera-avx-8002005515
C18 C21 = Сapacitor: as C29 on sheet МИЭМ.467999.001Э3; Value: 1uF; Package: 0603; ComponentLink1Description: Datasheet; ComponentLink1URL: *; ComponentLink2Description: Source; ComponentLink2URL: https://www.chipdip.ru/product/1mkf-x5r-10v-10-0603-grm185r61a105k-kondensator-murata-767906735
C19 C20 = Сapacitor: as C14 on sheet МИЭМ.467999.001Э3; Value: 100nF; Package: 0603; ComponentLink1Description: Datasheet; ComponentLink1URL: *; ComponentLink2Description: Source; ComponentLink2URL: https://www.chipdip.ru/product/0.1mkf-x7r-100v-10-0603-cc0603krx7r0bb104-kondensator-yageo-9000578715
DA3 = LD1117S50TR: Manufacturer: STMicroelectronics; Desc: табилизатор напряжения; VCC: 15 В; Vout: 5 В; Ta: 150 °C; Package: SOT-223; ComponentLink1Description: Datasheet; ComponentLink1URL: https://static.chipdip.ru/lib/432/DOC004432359.pdf; ComponentLink2Description: Source; ComponentLink2URL: https://www.chipdip.ru/product/ld1117s50tr-stabilizator-napryazheniya-st-microelectronics-9000143564
DA4 = LD39050PU33R: Manufacturer: STMicroelectronics; Desc: Стабилизатор напряжения линейный; VCC: 5.5 В; Vout: 3.3 В; Ta: 125 °C; ComponentLink1Description: Source; ComponentLink1URL: https://www.chipdip.ru/product/ld39050pu33r-regulyator-napryazheniya-st-microelectronics-9000811056; ComponentLink2Description: Datasheet; ComponentLink2URL: https://static.chipdip.ru/lib/843/DOC012843751.pdf; Package: DFN6 (3x3 mm)
R28 = Resistor: as R30 on sheet МИЭМ.467999.001Э3; Value: 4.7kOhm; Package: 0603; ComponentLink1Description: Datasheet; ComponentLink1URL: *; ComponentLink2Description: Source; ComponentLink2URL: https://www.chipdip.ru/product/0.1vt-0603-4.7-kom-5-rc0603jr-074k7l-chip-rezistor-yageo-9000301240
R32 = Resistor: PartNumber: RP0603DRD071KL; Manufacturer: Yageo; VCC: 50В; Power: 0.1Вт; Ta: 155°C; Tolerance: 0.5%; Value: 1kOhm; Package: 0603; ComponentLink1Description: Datasheet; ComponentLink1URL: *; ComponentLink2Description: Source; ComponentLink2URL: *
V3 = led: as V2 on sheet МИЭМ.467999.001Э3(2); PartNumber: FYLS-0603PGC; Package: 0603; Color: Зеленый; ComponentLink1Description: Source; ComponentLink1URL: https://www.chipdip.ru/product/fyls-0603pgc-svetodiod-smd-1-6x0-8mm-zelenyy-525nm-foryard-9000204615; Ta: *
VD4 = STPS2L30A: Manufacturer: STMicroelectronics; VCC: 30В; Desc: Диод Шоттки; Ta: 150°C; ComponentLink1Description: Source; ComponentLink1URL: https://www.chipdip.ru/product/stps2l30a-st-microelectronics-8001998231; Package: SMA; ComponentLink2Description: Datasheet; ComponentLink2URL: https://static.chipdip.ru/lib/314/DOC018314510.pdf
VT2 = STS7PF30L: Manufacturer: STMicroelectronics; VCC: 30В; Power: 2.5Вт; Ta: 150°C; Type: MOSFET; ComponentLink1Description: Source; ComponentLink1URL: https://www.chipdip.ru/product/sts7pf30l-vb-mop-tranzistor-30-v-9-a-18-m-10-p-kanal-vbsemi-8015911998; ComponentLink2Description: Datasheet; ComponentLink2URL: https://www.st.com/resource/en/datasheet/sts7pf30l.pdf; Package: SO-8; PartNumber: STS7PF30L
X5 = PLS_3: Desc: Соединение контактное; PartNumber: PLS_3
X6 = PLS_2: Desc: Соединение контактное; PartNumber: PLS_2

## Nets that join several sheets
+3V3: МИЭМ.467999.001Э3(2) (XP6.2 XP6.4 XP7.12 XP7.16), МИЭМ.467999.001Э3(3) (R23.1), МИЭМ.467999.001Э3(4) (C18.2 C19.2 DA4.4 X6.2)
+5V: МИЭМ.467999.001Э3(2) (XP6.5 XP7.18), МИЭМ.467999.001Э3(4) (6 pins)
AGND: МИЭМ.467999.001Э3 (C30.1 DD5.12 SB60.2), МИЭМ.467999.001Э3(2) (XP10.32)
AVDD: МИЭМ.467999.001Э3 (C30.2 DD5.13 FA1.1), МИЭМ.467999.001Э3(2) (XP5.3 XP10.7)
E5V: МИЭМ.467999.001Э3(2) (XP7.6), МИЭМ.467999.001Э3(3) (R7.2 VD3.2), МИЭМ.467999.001Э3(4) (VD4.1 X5.1)
GND: МИЭМ.467999.001Э3 (19 pins), МИЭМ.467999.001Э3(2) (10 pins), МИЭМ.467999.001Э3(3) (34 pins), МИЭМ.467999.001Э3(4) (10 pins)
U5V: МИЭМ.467999.001Э3(2) (XP10.8), МИЭМ.467999.001Э3(3) (R12.2 VD2.2 X1.1), МИЭМ.467999.001Э3(4) (R28.2 VT2.1 VT2.2 VT2.3)
VBAT/VLCD/VDD: МИЭМ.467999.001Э3 (C29.2 DD5.1 SB45.2), МИЭМ.467999.001Э3(2) (XP7.33)
VDD: МИЭМ.467999.001Э3 (9 pins), МИЭМ.467999.001Э3(2) (XP7.5), МИЭМ.467999.001Э3(4) (X6.1)
VIN: МИЭМ.467999.001Э3(2) (XP6.8 XP7.24), МИЭМ.467999.001Э3(4) (C16.1 DA3.3)
BOOT0: МИЭМ.467999.001Э3 (DD5.60 R33.2), МИЭМ.467999.001Э3(2) (XP7.7)
NRST: МИЭМ.467999.001Э3 (C14.2 DD5.7 SA2.2 SA2.3), МИЭМ.467999.001Э3(2) (XP6.3 XP7.14), МИЭМ.467999.001Э3(3) (SB12.2)
PA0: МИЭМ.467999.001Э3 (DD5.14), МИЭМ.467999.001Э3(2) (XP7.28 XP8.1)
PA1: МИЭМ.467999.001Э3 (DD5.15), МИЭМ.467999.001Э3(2) (XP7.30 XP8.2)
PA4: МИЭМ.467999.001Э3 (DD5.20), МИЭМ.467999.001Э3(2) (XP7.32 XP8.3)
PA5: МИЭМ.467999.001Э3 (DD5.21), МИЭМ.467999.001Э3(2) (R31.2 XP5.5 XP10.11)
PA6: МИЭМ.467999.001Э3 (DD5.22), МИЭМ.467999.001Э3(2) (XP5.6 XP10.13)
PA7: МИЭМ.467999.001Э3 (DD5.23), МИЭМ.467999.001Э3(2) (XP5.7 XP10.15)
PA8: МИЭМ.467999.001Э3 (DD5.41), МИЭМ.467999.001Э3(2) (XP9.1 XP10.23)
PA9: МИЭМ.467999.001Э3 (DD5.42), МИЭМ.467999.001Э3(2) (XP5.10 XP10.21)
PA10: МИЭМ.467999.001Э3 (DD5.43), МИЭМ.467999.001Э3(2) (XP9.6 XP10.33)
PA11: МИЭМ.467999.001Э3 (DD5.44), МИЭМ.467999.001Э3(2) (XP10.14)
PA12: МИЭМ.467999.001Э3 (DD5.45), МИЭМ.467999.001Э3(2) (XP10.12)
PA13: МИЭМ.467999.001Э3 (DD5.46), МИЭМ.467999.001Э3(2) (XP7.13), МИЭМ.467999.001Э3(3) (SB9.1)
PA14: МИЭМ.467999.001Э3 (DD5.49), МИЭМ.467999.001Э3(2) (XP7.15), МИЭМ.467999.001Э3(3) (SB5.1)
PA15: МИЭМ.467999.001Э3 (DD5.50), МИЭМ.467999.001Э3(2) (XP7.17)
PB0: МИЭМ.467999.001Э3 (DD5.26), МИЭМ.467999.001Э3(2) (XP7.34 XP8.4)
PB1: МИЭМ.467999.001Э3 (DD5.27), МИЭМ.467999.001Э3(2) (XP10.24)
PB2: МИЭМ.467999.001Э3 (DD5.28), МИЭМ.467999.001Э3(2) (XP10.22)
PB3: МИЭМ.467999.001Э3 (DD5.55), МИЭМ.467999.001Э3(2) (XP9.5 XP10.31), МИЭМ.467999.001Э3(3) (SB15.2)
PB4: МИЭМ.467999.001Э3 (DD5.56), МИЭМ.467999.001Э3(2) (XP9.3 XP10.27)
PB5: МИЭМ.467999.001Э3 (DD5.57), МИЭМ.467999.001Э3(2) (XP9.4 XP10.29)
PB6: МИЭМ.467999.001Э3 (DD5.58), МИЭМ.467999.001Э3(2) (XP5.8 XP10.17)
PB7: МИЭМ.467999.001Э3 (DD5.59), МИЭМ.467999.001Э3(2) (XP7.21)
PB8: МИЭМ.467999.001Э3 (DD5.61), МИЭМ.467999.001Э3(2) (XP5.1 XP10.3)
PB9: МИЭМ.467999.001Э3 (DD5.62), МИЭМ.467999.001Э3(2) (XP5.2 XP10.5)
PB10: МИЭМ.467999.001Э3 (DD5.29), МИЭМ.467999.001Э3(2) (XP9.2 XP10.25)
PB11: МИЭМ.467999.001Э3 (DD5.30), МИЭМ.467999.001Э3(2) (XP10.18)
PB12: МИЭМ.467999.001Э3 (DD5.33), МИЭМ.467999.001Э3(2) (XP10.16)
PB13: МИЭМ.467999.001Э3 (DD5.34), МИЭМ.467999.001Э3(2) (XP10.30)
PB14: МИЭМ.467999.001Э3 (DD5.35), МИЭМ.467999.001Э3(2) (XP10.28)
PB15: МИЭМ.467999.001Э3 (DD5.36), МИЭМ.467999.001Э3(2) (XP10.26)
PC0: МИЭМ.467999.001Э3 (DD5.8), МИЭМ.467999.001Э3(2) (XP7.38 XP8.6)
PC1: МИЭМ.467999.001Э3 (DD5.9), МИЭМ.467999.001Э3(2) (XP7.36 XP8.5)
PC2: МИЭМ.467999.001Э3 (DD5.10), МИЭМ.467999.001Э3(2) (XP7.35)
PC3: МИЭМ.467999.001Э3 (DD5.11), МИЭМ.467999.001Э3(2) (XP7.37)
PC4: МИЭМ.467999.001Э3 (DD5.24), МИЭМ.467999.001Э3(2) (XP10.34)
PC5: МИЭМ.467999.001Э3 (DD5.25), МИЭМ.467999.001Э3(2) (XP10.6)
PC6: МИЭМ.467999.001Э3 (DD5.37), МИЭМ.467999.001Э3(2) (XP10.4)
PC7: МИЭМ.467999.001Э3 (DD5.38), МИЭМ.467999.001Э3(2) (XP5.9 XP10.19)
PC8: МИЭМ.467999.001Э3 (DD5.39), МИЭМ.467999.001Э3(2) (XP10.2)
PC9: МИЭМ.467999.001Э3 (DD5.40), МИЭМ.467999.001Э3(2) (XP10.1)
PC10: МИЭМ.467999.001Э3 (DD5.51), МИЭМ.467999.001Э3(2) (XP7.1)
PC11: МИЭМ.467999.001Э3 (DD5.52), МИЭМ.467999.001Э3(2) (XP7.2)
PC12: МИЭМ.467999.001Э3 (DD5.53), МИЭМ.467999.001Э3(2) (XP7.3)
PC13: МИЭМ.467999.001Э3 (5 pins), МИЭМ.467999.001Э3(2) (XP7.23)
PD2: МИЭМ.467999.001Э3 (DD5.54), МИЭМ.467999.001Э3(2) (XP7.4)
PF0: МИЭМ.467999.001Э3 (DD5.5 R35.2), МИЭМ.467999.001Э3(3) (R25.1)
PF1: МИЭМ.467999.001Э3 (DD5.6 R37.2), МИЭМ.467999.001Э3(2) (XP7.31)
PF4: МИЭМ.467999.001Э3 (DD5.18), МИЭМ.467999.001Э3(2) (XP10.38)
PF5: МИЭМ.467999.001Э3 (DD5.19), МИЭМ.467999.001Э3(2) (XP10.36)
PF6: МИЭМ.467999.001Э3 (DD5.47), МИЭМ.467999.001Э3(2) (XP7.9)
PF7: МИЭМ.467999.001Э3 (DD5.48), МИЭМ.467999.001Э3(2) (XP7.11)
PWR_ENn: МИЭМ.467999.001Э3(3) (DD2.28), МИЭМ.467999.001Э3(4) (R28.1 VT2.4)
STLINK_RX: МИЭМ.467999.001Э3 (DD5.16), МИЭМ.467999.001Э3(3) (DD2.13 XP3.2)
STLINK_TX: МИЭМ.467999.001Э3 (DD5.17), МИЭМ.467999.001Э3(3) (DD2.12 XP3.1)